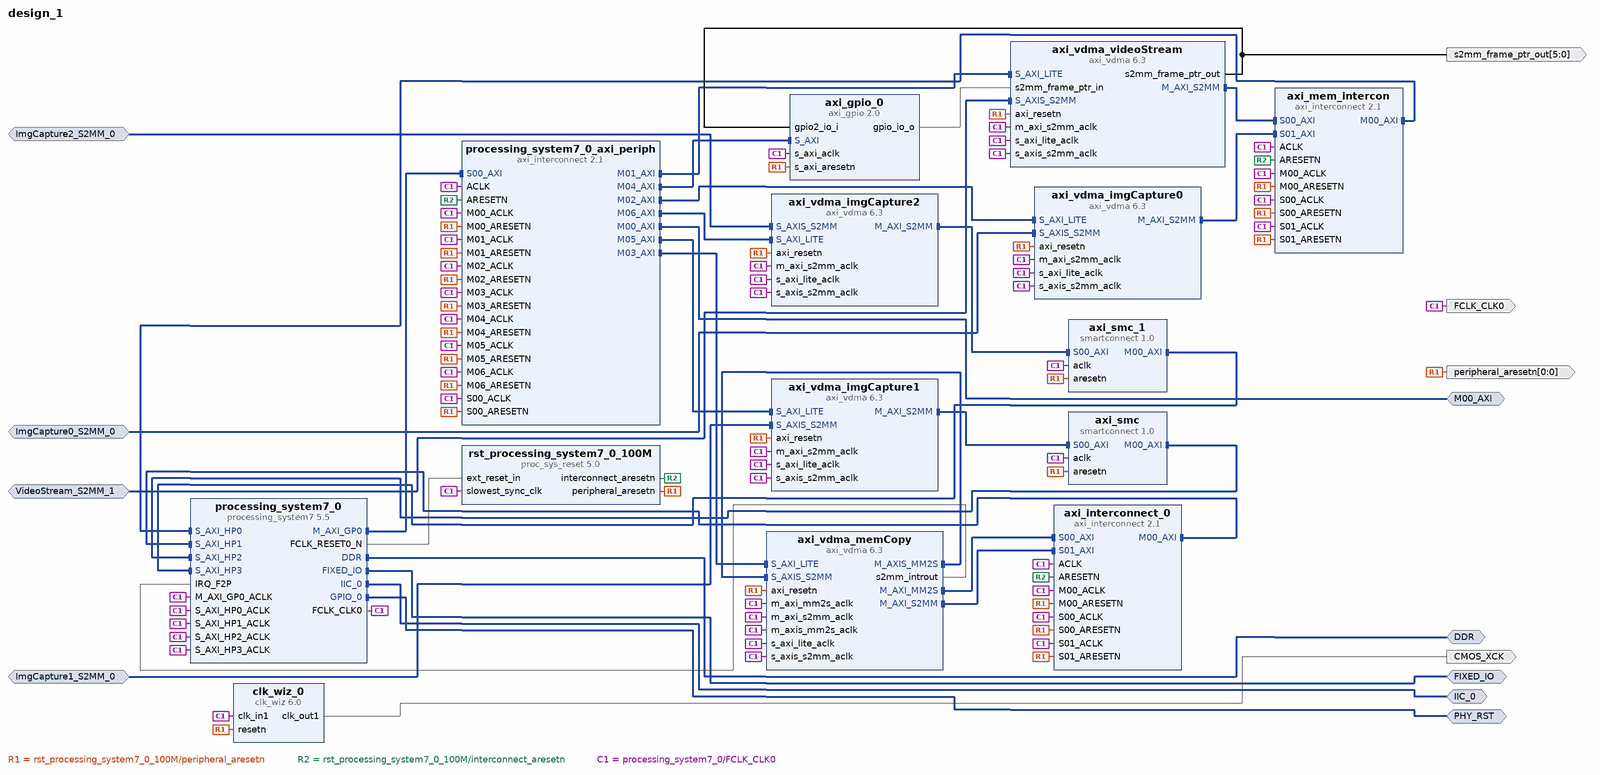
[diagram p0: block diagram of the top level]
# Vivado block design design_1, xc7z020clg400-1, Vivado 2018.2
create_bd_design design_1

create_bd_intf_port -mode Master -vlnv xilinx.com:interface:ddrx_rtl:1.0 DDR
create_bd_intf_port -mode Master -vlnv xilinx.com:display_processing_system7:fixedio_rtl:1.0 FIXED_IO
create_bd_intf_port -mode Master -vlnv xilinx.com:interface:iic_rtl:1.0 IIC_0
create_bd_intf_port -mode Master -vlnv xilinx.com:interface:aximm_rtl:1.0 M00_AXI
set_property -dict [list \
  CONFIG.DATA_WIDTH 32 \
  CONFIG.PROTOCOL AXI4LITE \
  CONFIG.ADDR_WIDTH 32 \
  CONFIG.HAS_BURST 0 \
  CONFIG.HAS_LOCK 0 \
  CONFIG.HAS_CACHE 0 \
  CONFIG.HAS_QOS 0 \
  CONFIG.HAS_REGION 0 \
  CONFIG.NUM_READ_OUTSTANDING 2 \
  CONFIG.NUM_WRITE_OUTSTANDING 2 \
] [get_bd_intf_ports M00_AXI]
create_bd_intf_port -mode Slave -vlnv xilinx.com:interface:axis_rtl:1.0 ImgCapture0_S2MM_0
set_property -dict [list \
  CONFIG.TDATA_NUM_BYTES 1 \
  CONFIG.TDEST_WIDTH 0 \
  CONFIG.TID_WIDTH 0 \
  CONFIG.TUSER_WIDTH 1 \
  CONFIG.HAS_TREADY 1 \
  CONFIG.HAS_TSTRB 0 \
  CONFIG.HAS_TKEEP 1 \
  CONFIG.HAS_TLAST 1 \
  CONFIG.FREQ_HZ 100000000 \
  CONFIG.PHASE 0.000 \
  CONFIG.LAYERED_METADATA undef \
] [get_bd_intf_ports ImgCapture0_S2MM_0]
create_bd_intf_port -mode Slave -vlnv xilinx.com:interface:axis_rtl:1.0 VideoStream_S2MM_1
set_property -dict [list \
  CONFIG.TDATA_NUM_BYTES 1 \
  CONFIG.TDEST_WIDTH 0 \
  CONFIG.TID_WIDTH 0 \
  CONFIG.TUSER_WIDTH 1 \
  CONFIG.HAS_TREADY 1 \
  CONFIG.HAS_TSTRB 0 \
  CONFIG.HAS_TKEEP 1 \
  CONFIG.HAS_TLAST 1 \
  CONFIG.FREQ_HZ 100000000 \
  CONFIG.PHASE 0.000 \
  CONFIG.LAYERED_METADATA undef \
] [get_bd_intf_ports VideoStream_S2MM_1]
create_bd_intf_port -mode Slave -vlnv xilinx.com:interface:axis_rtl:1.0 ImgCapture1_S2MM_0
set_property -dict [list \
  CONFIG.TDATA_NUM_BYTES 1 \
  CONFIG.TDEST_WIDTH 0 \
  CONFIG.TID_WIDTH 0 \
  CONFIG.TUSER_WIDTH 1 \
  CONFIG.HAS_TREADY 1 \
  CONFIG.HAS_TSTRB 0 \
  CONFIG.HAS_TKEEP 1 \
  CONFIG.HAS_TLAST 1 \
  CONFIG.LAYERED_METADATA undef \
] [get_bd_intf_ports ImgCapture1_S2MM_0]
create_bd_intf_port -mode Slave -vlnv xilinx.com:interface:axis_rtl:1.0 ImgCapture2_S2MM_0
set_property -dict [list \
  CONFIG.TDATA_NUM_BYTES 1 \
  CONFIG.TDEST_WIDTH 0 \
  CONFIG.TID_WIDTH 0 \
  CONFIG.TUSER_WIDTH 1 \
  CONFIG.HAS_TREADY 1 \
  CONFIG.HAS_TSTRB 0 \
  CONFIG.HAS_TKEEP 1 \
  CONFIG.HAS_TLAST 1 \
  CONFIG.LAYERED_METADATA undef \
] [get_bd_intf_ports ImgCapture2_S2MM_0]
create_bd_intf_port -mode Master -vlnv xilinx.com:interface:gpio_rtl:1.0 PHY_RST
create_bd_port -dir O -from 0 -to 0 -type rst peripheral_aresetn
create_bd_port -dir O CMOS_XCK
create_bd_port -dir O FCLK_CLK0
create_bd_port -dir O -from 5 -to 0 s2mm_frame_ptr_out

create_bd_cell -type ip -vlnv xilinx.com:ip:processing_system7:5.5 processing_system7_0
set_property -dict [list \
  CONFIG.PCW_FCLK_CLK1_BUF TRUE \
  CONFIG.PCW_UIPARAM_DDR_FREQ_MHZ 533.333333 \
  CONFIG.PCW_APU_PERIPHERAL_FREQMHZ 666.666666 \
  CONFIG.PCW_UART_PERIPHERAL_FREQMHZ 100 \
  CONFIG.PCW_I2C_PERIPHERAL_FREQMHZ 111.111115 \
  CONFIG.PCW_FPGA0_PERIPHERAL_FREQMHZ 100 \
  CONFIG.PCW_FPGA1_PERIPHERAL_FREQMHZ 140 \
  CONFIG.PCW_USE_S_AXI_HP0 1 \
  CONFIG.PCW_USE_S_AXI_HP1 1 \
  CONFIG.PCW_USE_S_AXI_HP2 1 \
  CONFIG.PCW_USE_S_AXI_HP3 1 \
  CONFIG.PCW_USE_FABRIC_INTERRUPT 1 \
  CONFIG.PCW_GPIO_EMIO_GPIO_WIDTH 1 \
  CONFIG.PCW_EN_CLK1_PORT 1 \
  CONFIG.PCW_IRQ_F2P_INTR 1 \
  CONFIG.PCW_GP0_EN_MODIFIABLE_TXN 0 \
  CONFIG.PCW_GP1_EN_MODIFIABLE_TXN 0 \
  CONFIG.PCW_PERIPHERAL_BOARD_PRESET None \
  CONFIG.PCW_PRESET_BANK1_VOLTAGE {LVCMOS 1.8V} \
  CONFIG.PCW_UIPARAM_DDR_BUS_WIDTH {16 Bit} \
  CONFIG.PCW_UIPARAM_DDR_PARTNO {MT41K256M16 RE-125} \
  CONFIG.PCW_NAND_PERIPHERAL_ENABLE 1 \
  CONFIG.PCW_NAND_NAND_IO {MIO 0 2.. 14} \
  CONFIG.PCW_ENET0_PERIPHERAL_ENABLE 1 \
  CONFIG.PCW_ENET0_ENET0_IO {MIO 16 .. 27} \
  CONFIG.PCW_ENET0_GRP_MDIO_ENABLE 1 \
  CONFIG.PCW_ENET0_GRP_MDIO_IO {MIO 52 .. 53} \
  CONFIG.PCW_SD0_PERIPHERAL_ENABLE 0 \
  CONFIG.PCW_UART1_PERIPHERAL_ENABLE 1 \
  CONFIG.PCW_UART1_UART1_IO {MIO 48 .. 49} \
  CONFIG.PCW_USB0_PERIPHERAL_ENABLE 0 \
  CONFIG.PCW_I2C0_PERIPHERAL_ENABLE 1 \
  CONFIG.PCW_I2C0_I2C0_IO EMIO \
  CONFIG.PCW_GPIO_MIO_GPIO_ENABLE 0 \
  CONFIG.PCW_GPIO_EMIO_GPIO_ENABLE 1 \
  CONFIG.PCW_GPIO_EMIO_GPIO_IO 1 \
  CONFIG.PCW_FPGA_FCLK1_ENABLE 1 \
] [get_bd_cells processing_system7_0]
# 428 more settings of processing_system7_0 are not shown: defaults, MIO pin electricals, DDR timing, and values the tool derives
create_bd_cell -type ip -vlnv xilinx.com:ip:proc_sys_reset:5.0 rst_processing_system7_0_100M
create_bd_cell -type ip -vlnv xilinx.com:ip:axi_gpio:2.0 axi_gpio_0
set_property -dict [list \
  CONFIG.C_GPIO_WIDTH 6 \
  CONFIG.C_GPIO2_WIDTH 6 \
  CONFIG.C_IS_DUAL 1 \
  CONFIG.C_ALL_INPUTS_2 1 \
  CONFIG.C_ALL_OUTPUTS 1 \
] [get_bd_cells axi_gpio_0]
create_bd_cell -type ip -vlnv xilinx.com:ip:axi_interconnect:2.1 axi_interconnect_0
set_property -dict {CONFIG.NUM_SI 2 CONFIG.NUM_MI 1 CONFIG.SYNCHRONIZATION_STAGES 2} [get_bd_cells axi_interconnect_0]
create_bd_cell -type ip -vlnv xilinx.com:ip:axi_interconnect:2.1 axi_mem_intercon
set_property -dict {CONFIG.NUM_SI 2 CONFIG.NUM_MI 1 CONFIG.SYNCHRONIZATION_STAGES 2} [get_bd_cells axi_mem_intercon]
create_bd_cell -type ip -vlnv xilinx.com:ip:smartconnect:1.0 axi_smc
set_property -dict {CONFIG.NUM_SI 1} [get_bd_cells axi_smc]
create_bd_cell -type ip -vlnv xilinx.com:ip:smartconnect:1.0 axi_smc_1
set_property -dict {CONFIG.NUM_SI 1} [get_bd_cells axi_smc_1]
create_bd_cell -type ip -vlnv xilinx.com:ip:axi_vdma:6.3 axi_vdma_imgCapture1
set_property -dict [list \
  CONFIG.c_num_fstores 1 \
  CONFIG.c_s2mm_linebuffer_depth 4096 \
  CONFIG.c_include_mm2s 0 \
] [get_bd_cells axi_vdma_imgCapture1]
create_bd_cell -type ip -vlnv xilinx.com:ip:axi_vdma:6.3 axi_vdma_videoStream
set_property -dict [list \
  CONFIG.c_num_fstores 4 \
  CONFIG.c_s2mm_linebuffer_depth 4096 \
  CONFIG.c_include_mm2s 0 \
] [get_bd_cells axi_vdma_videoStream]
create_bd_cell -type ip -vlnv xilinx.com:ip:axi_vdma:6.3 axi_vdma_memCopy
set_property -dict {CONFIG.c_num_fstores 1} [get_bd_cells axi_vdma_memCopy]
create_bd_cell -type ip -vlnv xilinx.com:ip:axi_vdma:6.3 axi_vdma_imgCapture0
set_property -dict [list \
  CONFIG.c_num_fstores 1 \
  CONFIG.c_s2mm_linebuffer_depth 4096 \
  CONFIG.c_include_mm2s 0 \
] [get_bd_cells axi_vdma_imgCapture0]
create_bd_cell -type ip -vlnv xilinx.com:ip:axi_vdma:6.3 axi_vdma_imgCapture2
set_property -dict [list \
  CONFIG.c_num_fstores 1 \
  CONFIG.c_s2mm_linebuffer_depth 4096 \
  CONFIG.c_include_mm2s 0 \
] [get_bd_cells axi_vdma_imgCapture2]
create_bd_cell -type ip -vlnv xilinx.com:ip:clk_wiz:6.0 clk_wiz_0
set_property -dict [list \
  CONFIG.PRIMITIVE MMCM \
  CONFIG.CLKOUT1_REQUESTED_OUT_FREQ 24 \
  CONFIG.CLKOUT1_DRIVES BUFG \
  CONFIG.CLKOUT2_DRIVES BUFG \
  CONFIG.CLKOUT3_DRIVES BUFG \
  CONFIG.CLKOUT4_DRIVES BUFG \
  CONFIG.CLKOUT5_DRIVES BUFG \
  CONFIG.CLKOUT6_DRIVES BUFG \
  CONFIG.CLKOUT7_DRIVES BUFG \
  CONFIG.FEEDBACK_SOURCE FDBK_AUTO \
  CONFIG.RESET_PORT resetn \
  CONFIG.MMCM_DIVCLK_DIVIDE 5 \
  CONFIG.MMCM_CLKFBOUT_MULT_F 50.250 \
  CONFIG.MMCM_CLKIN1_PERIOD 10.000 \
  CONFIG.MMCM_CLKIN2_PERIOD 10.000 \
  CONFIG.MMCM_COMPENSATION ZHOLD \
  CONFIG.MMCM_CLKOUT0_DIVIDE_F 41.875 \
  CONFIG.RESET_TYPE ACTIVE_LOW \
  CONFIG.CLKOUT1_JITTER 305.592 \
  CONFIG.CLKOUT1_PHASE_ERROR 298.923 \
] [get_bd_cells clk_wiz_0]
create_bd_cell -type ip -vlnv xilinx.com:ip:axi_interconnect:2.1 processing_system7_0_axi_periph
set_property -dict {CONFIG.NUM_MI 7 CONFIG.SYNCHRONIZATION_STAGES 2} [get_bd_cells processing_system7_0_axi_periph]

# ---- connections ----

connect_bd_intf_net [get_bd_intf_pins axi_mem_intercon/M00_AXI] [get_bd_intf_pins processing_system7_0/S_AXI_HP0]
connect_bd_intf_net [get_bd_intf_pins processing_system7_0/M_AXI_GP0] [get_bd_intf_pins processing_system7_0_axi_periph/S00_AXI]
connect_bd_intf_net [get_bd_intf_pins processing_system7_0_axi_periph/M01_AXI] [get_bd_intf_pins axi_vdma_videoStream/S_AXI_LITE]
connect_bd_intf_net -intf_net axi_vdma_0_M_AXI_S2MM [get_bd_intf_pins axi_vdma_videoStream/M_AXI_S2MM] [get_bd_intf_pins axi_mem_intercon/S00_AXI]
connect_bd_intf_net [get_bd_intf_pins processing_system7_0_axi_periph/M02_AXI] [get_bd_intf_pins axi_vdma_imgCapture0/S_AXI_LITE]
connect_bd_intf_net -intf_net axi_vdma_1_M_AXI_S2MM [get_bd_intf_pins axi_vdma_imgCapture0/M_AXI_S2MM] [get_bd_intf_pins axi_mem_intercon/S01_AXI]
connect_bd_intf_net [get_bd_intf_pins axi_interconnect_0/M00_AXI] [get_bd_intf_pins processing_system7_0/S_AXI_HP1]
connect_bd_intf_net [get_bd_intf_pins processing_system7_0_axi_periph/M03_AXI] [get_bd_intf_pins axi_vdma_memCopy/S_AXI_LITE]
connect_bd_intf_net -intf_net axi_vdma_0_M_AXI_MM2S [get_bd_intf_pins axi_vdma_memCopy/M_AXI_MM2S] [get_bd_intf_pins axi_interconnect_0/S00_AXI]
connect_bd_intf_net -intf_net axi_vdma_0_M_AXI_S2MM1 [get_bd_intf_pins axi_vdma_memCopy/M_AXI_S2MM] [get_bd_intf_pins axi_interconnect_0/S01_AXI]
connect_bd_intf_net -intf_net axi_vdma_0_M_AXIS_MM2S [get_bd_intf_pins axi_vdma_memCopy/M_AXIS_MM2S] [get_bd_intf_pins axi_vdma_memCopy/S_AXIS_S2MM]
connect_bd_intf_net [get_bd_intf_pins processing_system7_0_axi_periph/M04_AXI] [get_bd_intf_pins axi_gpio_0/S_AXI]
connect_bd_intf_net [get_bd_intf_pins processing_system7_0_axi_periph/M05_AXI] [get_bd_intf_pins axi_vdma_imgCapture1/S_AXI_LITE]
connect_bd_intf_net [get_bd_intf_pins processing_system7_0_axi_periph/M06_AXI] [get_bd_intf_pins axi_vdma_imgCapture2/S_AXI_LITE]
connect_bd_intf_net [get_bd_intf_pins axi_vdma_imgCapture1/M_AXI_S2MM] [get_bd_intf_pins axi_smc/S00_AXI]
connect_bd_intf_net [get_bd_intf_pins axi_smc/M00_AXI] [get_bd_intf_pins processing_system7_0/S_AXI_HP2]
connect_bd_intf_net [get_bd_intf_pins axi_vdma_imgCapture2/M_AXI_S2MM] [get_bd_intf_pins axi_smc_1/S00_AXI]
connect_bd_intf_net [get_bd_intf_pins axi_smc_1/M00_AXI] [get_bd_intf_pins processing_system7_0/S_AXI_HP3]
connect_bd_intf_net [get_bd_intf_ports DDR] [get_bd_intf_pins processing_system7_0/DDR]
connect_bd_intf_net [get_bd_intf_ports FIXED_IO] [get_bd_intf_pins processing_system7_0/FIXED_IO]
connect_bd_intf_net [get_bd_intf_ports IIC_0] [get_bd_intf_pins processing_system7_0/IIC_0]
connect_bd_intf_net [get_bd_intf_ports M00_AXI] [get_bd_intf_pins processing_system7_0_axi_periph/M00_AXI]
connect_bd_intf_net [get_bd_intf_ports ImgCapture0_S2MM_0] [get_bd_intf_pins axi_vdma_imgCapture0/S_AXIS_S2MM]
connect_bd_intf_net -intf_net S_AXIS_S2MM_1_1 [get_bd_intf_ports VideoStream_S2MM_1] [get_bd_intf_pins axi_vdma_videoStream/S_AXIS_S2MM]
connect_bd_intf_net -intf_net S_AXIS_S2MM_0_1 [get_bd_intf_ports ImgCapture1_S2MM_0] [get_bd_intf_pins axi_vdma_imgCapture1/S_AXIS_S2MM]
connect_bd_intf_net -intf_net S_AXIS_S2MM_0_2 [get_bd_intf_ports ImgCapture2_S2MM_0] [get_bd_intf_pins axi_vdma_imgCapture2/S_AXIS_S2MM]
connect_bd_intf_net [get_bd_intf_ports PHY_RST] [get_bd_intf_pins processing_system7_0/GPIO_0]
connect_bd_net [get_bd_pins processing_system7_0/FCLK_RESET0_N] [get_bd_pins rst_processing_system7_0_100M/ext_reset_in]
connect_bd_net [get_bd_pins rst_processing_system7_0_100M/peripheral_aresetn] \
  [get_bd_ports peripheral_aresetn] [get_bd_pins axi_gpio_0/s_axi_aresetn] [get_bd_pins axi_smc/aresetn] \
  [get_bd_pins axi_smc_1/aresetn] [get_bd_pins axi_vdma_imgCapture1/axi_resetn] [get_bd_pins axi_vdma_videoStream/axi_resetn] \
  [get_bd_pins axi_vdma_memCopy/axi_resetn] [get_bd_pins axi_vdma_imgCapture0/axi_resetn] \
  [get_bd_pins axi_vdma_imgCapture2/axi_resetn] [get_bd_pins clk_wiz_0/resetn] [get_bd_pins axi_interconnect_0/S00_ARESETN] \
  [get_bd_pins axi_interconnect_0/S01_ARESETN] [get_bd_pins axi_interconnect_0/M00_ARESETN] \
  [get_bd_pins axi_mem_intercon/S00_ARESETN] [get_bd_pins axi_mem_intercon/S01_ARESETN] \
  [get_bd_pins axi_mem_intercon/M00_ARESETN] [get_bd_pins processing_system7_0_axi_periph/S00_ARESETN] \
  [get_bd_pins processing_system7_0_axi_periph/M00_ARESETN] [get_bd_pins processing_system7_0_axi_periph/M01_ARESETN] \
  [get_bd_pins processing_system7_0_axi_periph/M02_ARESETN] [get_bd_pins processing_system7_0_axi_periph/M03_ARESETN] \
  [get_bd_pins processing_system7_0_axi_periph/M04_ARESETN] [get_bd_pins processing_system7_0_axi_periph/M05_ARESETN] \
  [get_bd_pins processing_system7_0_axi_periph/M06_ARESETN]
connect_bd_net [get_bd_pins rst_processing_system7_0_100M/interconnect_aresetn] \
  [get_bd_pins axi_interconnect_0/ARESETN] [get_bd_pins axi_mem_intercon/ARESETN] \
  [get_bd_pins processing_system7_0_axi_periph/ARESETN]
connect_bd_net [get_bd_pins clk_wiz_0/clk_out1] [get_bd_ports CMOS_XCK]
connect_bd_net [get_bd_pins processing_system7_0/FCLK_CLK0] \
  [get_bd_ports FCLK_CLK0] [get_bd_pins processing_system7_0/M_AXI_GP0_ACLK] \
  [get_bd_pins processing_system7_0/S_AXI_HP0_ACLK] [get_bd_pins processing_system7_0/S_AXI_HP1_ACLK] \
  [get_bd_pins rst_processing_system7_0_100M/slowest_sync_clk] [get_bd_pins processing_system7_0/S_AXI_HP2_ACLK] \
  [get_bd_pins processing_system7_0/S_AXI_HP3_ACLK] [get_bd_pins axi_gpio_0/s_axi_aclk] [get_bd_pins axi_smc/aclk] \
  [get_bd_pins axi_smc_1/aclk] [get_bd_pins axi_vdma_imgCapture1/s_axi_lite_aclk] \
  [get_bd_pins axi_vdma_imgCapture1/m_axi_s2mm_aclk] [get_bd_pins axi_vdma_imgCapture1/s_axis_s2mm_aclk] \
  [get_bd_pins axi_vdma_videoStream/s_axi_lite_aclk] [get_bd_pins axi_vdma_videoStream/m_axi_s2mm_aclk] \
  [get_bd_pins axi_vdma_videoStream/s_axis_s2mm_aclk] [get_bd_pins axi_vdma_memCopy/s_axi_lite_aclk] \
  [get_bd_pins axi_vdma_memCopy/m_axi_mm2s_aclk] [get_bd_pins axi_vdma_memCopy/m_axis_mm2s_aclk] \
  [get_bd_pins axi_vdma_memCopy/m_axi_s2mm_aclk] [get_bd_pins axi_vdma_memCopy/s_axis_s2mm_aclk] \
  [get_bd_pins axi_vdma_imgCapture0/s_axi_lite_aclk] [get_bd_pins axi_vdma_imgCapture0/m_axi_s2mm_aclk] \
  [get_bd_pins axi_vdma_imgCapture0/s_axis_s2mm_aclk] [get_bd_pins axi_vdma_imgCapture2/s_axi_lite_aclk] \
  [get_bd_pins axi_vdma_imgCapture2/m_axi_s2mm_aclk] [get_bd_pins axi_vdma_imgCapture2/s_axis_s2mm_aclk] \
  [get_bd_pins clk_wiz_0/clk_in1] [get_bd_pins axi_interconnect_0/ACLK] [get_bd_pins axi_interconnect_0/S00_ACLK] \
  [get_bd_pins axi_interconnect_0/S01_ACLK] [get_bd_pins axi_interconnect_0/M00_ACLK] [get_bd_pins axi_mem_intercon/ACLK] \
  [get_bd_pins axi_mem_intercon/S00_ACLK] [get_bd_pins axi_mem_intercon/S01_ACLK] [get_bd_pins axi_mem_intercon/M00_ACLK] \
  [get_bd_pins processing_system7_0_axi_periph/ACLK] [get_bd_pins processing_system7_0_axi_periph/S00_ACLK] \
  [get_bd_pins processing_system7_0_axi_periph/M00_ACLK] [get_bd_pins processing_system7_0_axi_periph/M01_ACLK] \
  [get_bd_pins processing_system7_0_axi_periph/M02_ACLK] [get_bd_pins processing_system7_0_axi_periph/M03_ACLK] \
  [get_bd_pins processing_system7_0_axi_periph/M04_ACLK] [get_bd_pins processing_system7_0_axi_periph/M05_ACLK] \
  [get_bd_pins processing_system7_0_axi_periph/M06_ACLK]
connect_bd_net -net axi_vdma_1_s2mm_frame_ptr_out [get_bd_pins axi_vdma_videoStream/s2mm_frame_ptr_out] \
  [get_bd_ports s2mm_frame_ptr_out] [get_bd_pins axi_gpio_0/gpio2_io_i]
connect_bd_net [get_bd_pins axi_vdma_memCopy/s2mm_introut] [get_bd_pins processing_system7_0/IRQ_F2P]
connect_bd_net [get_bd_pins axi_gpio_0/gpio_io_o] [get_bd_pins axi_vdma_videoStream/s2mm_frame_ptr_in]

# ---- address map ----
assign_bd_address -offset 0x00000000 -range 512M -target_address_space [get_bd_addr_spaces axi_vdma_imgCapture0/Data_S2MM] [get_bd_addr_segs processing_system7_0/S_AXI_HP0/HP0_DDR_LOWOCM]
assign_bd_address -offset 0x00000000 -range 512M -target_address_space [get_bd_addr_spaces axi_vdma_imgCapture1/Data_S2MM] [get_bd_addr_segs processing_system7_0/S_AXI_HP2/HP2_DDR_LOWOCM]
assign_bd_address -offset 0x00000000 -range 512M -target_address_space [get_bd_addr_spaces axi_vdma_imgCapture2/Data_S2MM] [get_bd_addr_segs processing_system7_0/S_AXI_HP3/HP3_DDR_LOWOCM]
assign_bd_address -offset 0x00000000 -range 512M -target_address_space [get_bd_addr_spaces axi_vdma_memCopy/Data_MM2S] [get_bd_addr_segs processing_system7_0/S_AXI_HP1/HP1_DDR_LOWOCM]
assign_bd_address -offset 0x00000000 -range 512M -target_address_space [get_bd_addr_spaces axi_vdma_memCopy/Data_S2MM] [get_bd_addr_segs processing_system7_0/S_AXI_HP1/HP1_DDR_LOWOCM]
assign_bd_address -offset 0x00000000 -range 512M -target_address_space [get_bd_addr_spaces axi_vdma_videoStream/Data_S2MM] [get_bd_addr_segs processing_system7_0/S_AXI_HP0/HP0_DDR_LOWOCM]
assign_bd_address -offset 0x41200000 -range 64K -target_address_space [get_bd_addr_spaces processing_system7_0/Data] [get_bd_addr_segs axi_gpio_0/S_AXI/Reg]
assign_bd_address -offset 0x43000000 -range 64K -target_address_space [get_bd_addr_spaces processing_system7_0/Data] [get_bd_addr_segs axi_vdma_videoStream/S_AXI_LITE/Reg]
assign_bd_address -offset 0x43010000 -range 64K -target_address_space [get_bd_addr_spaces processing_system7_0/Data] [get_bd_addr_segs axi_vdma_imgCapture0/S_AXI_LITE/Reg]
assign_bd_address -offset 0x43020000 -range 64K -target_address_space [get_bd_addr_spaces processing_system7_0/Data] [get_bd_addr_segs axi_vdma_memCopy/S_AXI_LITE/Reg]
assign_bd_address -offset 0x43030000 -range 64K -target_address_space [get_bd_addr_spaces processing_system7_0/Data] [get_bd_addr_segs axi_vdma_imgCapture1/S_AXI_LITE/Reg]
assign_bd_address -offset 0x43040000 -range 64K -target_address_space [get_bd_addr_spaces processing_system7_0/Data] [get_bd_addr_segs axi_vdma_imgCapture2/S_AXI_LITE/Reg]
assign_bd_address -offset 0x43C00000 -range 64K -target_address_space [get_bd_addr_spaces processing_system7_0/Data] [get_bd_addr_segs M00_AXI/Reg]

validate_bd_design
save_bd_design
